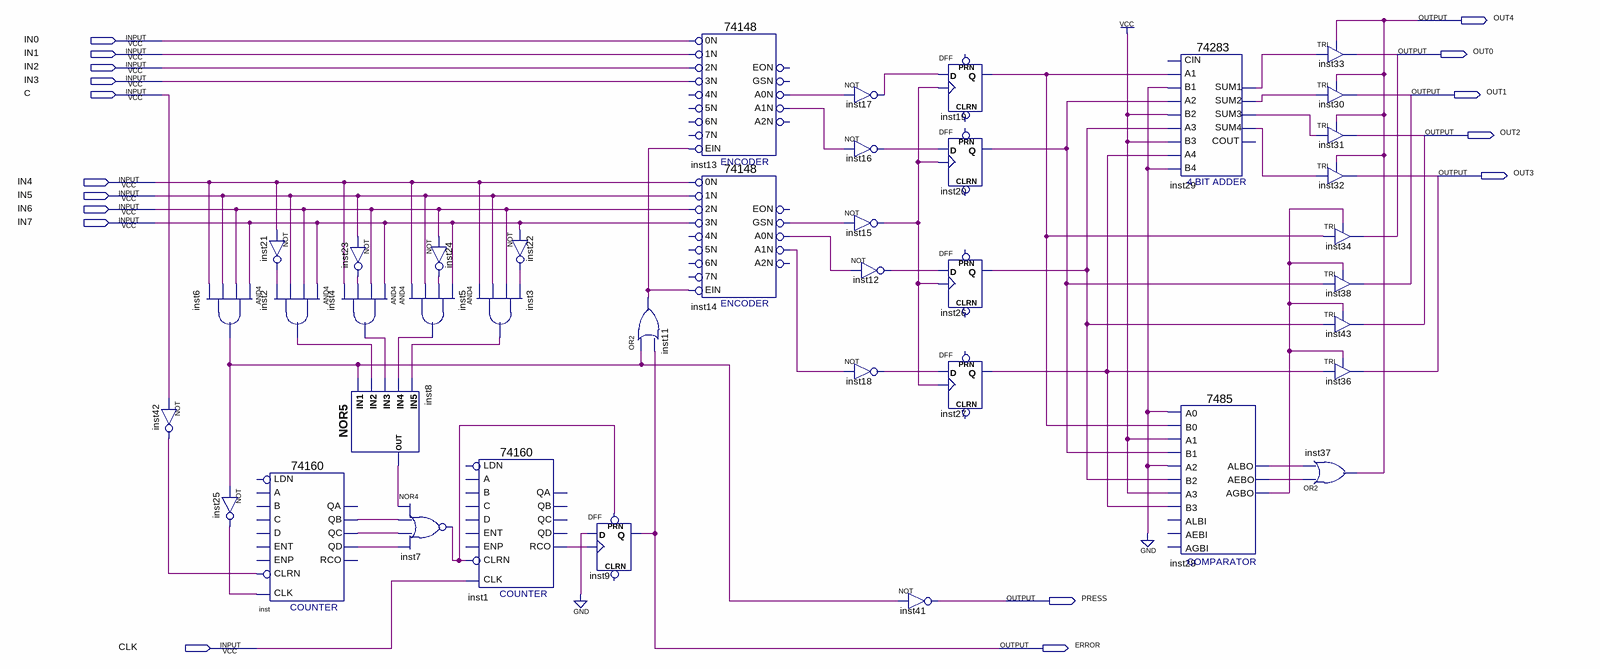
[diagram p0: schematic sheet]
// Quartus schematic detect.bdf as structural Verilog: 40 symbols, 17 pins
module detect (
  input  IN0,
  input  IN1,
  input  IN2,
  input  IN3,
  input  C,
  input  IN4,
  input  IN5,
  input  IN6,
  input  IN7,
  input  CLK,
  output OUT4,
  output OUT0,
  output OUT1,
  output OUT2,
  output OUT3,
  output PRESS,
  output ERROR
);

  wire inst1_rco, inst2_out, inst3_out, inst4_out, inst5_out, inst6_out, inst7_out, inst8_out, inst11_out,
       inst12_out, inst13_a0n, inst13_a1n, inst14_a0n, inst14_a1n, inst14_gsn, inst15_out, inst16_out,
       inst17_out, inst18_out, inst19_q, inst20_q, inst21_out, inst22_out, inst23_out, inst24_out,
       inst25_out, inst26_q, inst27_q, inst28_aebo, inst28_agbo, inst28_albo, inst29_sum1, inst29_sum2,
       inst29_sum3, inst29_sum4, inst42_out, inst_qb, inst_qc, inst_qd;

  not inst42 (inst42_out, C);
  and inst6 (inst6_out, IN7, IN6, IN5, IN4);
  not inst21 (inst21_out, IN4);
  and inst2 (inst2_out, IN7, IN6, IN5, inst21_out);
  \74160  inst (
    .CLK(inst25_out), .CLRN(inst42_out), .QD(inst_qd), .QB(inst_qb), .QC(inst_qc));  // open: ENT, A, B, C, D, LDN, ENP, QA, RCO
  not inst25 (inst25_out, inst6_out);
  not inst23 (inst23_out, IN5);
  and inst4 (inst4_out, IN7, IN6, inst23_out, IN4);
  nor inst8 (inst8_out, inst6_out, inst2_out, inst4_out, inst5_out, inst3_out);
  not inst24 (inst24_out, IN6);
  and inst5 (inst5_out, IN4, IN5, inst24_out, IN7);
  nor inst7 (inst7_out, inst8_out, inst_qb, inst_qc, inst_qd);
  and inst3 (inst3_out, IN4, IN5, IN6, inst22_out);
  \74160  inst1 (.CLK(CLK), .CLRN(inst7_out), .RCO(inst1_rco));  // open: ENT, A, B, C, D, LDN, ENP, QD, QA, QB, QC
  not inst22 (inst22_out, IN7);
  DFF inst9 (.CLK(inst1_rco), .D(1'b0), .PRN(inst7_out), .Q(ERROR));  // open: CLRN
  or inst11 (inst11_out, inst6_out, ERROR);
  \74148  inst13 (
    .\0N (IN0), .\1N (IN1), .\2N (IN2), .\3N (IN3), .EIN(inst11_out), .A1N(inst13_a1n), .A0N(inst13_a0n));  // open: 5N, 4N, 6N, 7N, A2N, EON, GSN
  \74148  inst14 (
    .\0N (IN4), .\1N (IN5), .\2N (IN6), .\3N (IN7), .EIN(inst11_out), .A1N(inst14_a1n), .A0N(inst14_a0n),
    .GSN(inst14_gsn));  // open: 5N, 4N, 6N, 7N, A2N, EON
  not inst17 (inst17_out, inst13_a0n);
  not inst16 (inst16_out, inst13_a1n);
  not inst15 (inst15_out, inst14_gsn);
  not inst12 (inst12_out, inst14_a0n);
  not inst18 (inst18_out, inst14_a1n);
  not inst41 (PRESS, inst6_out);
  DFF inst19 (.CLK(inst15_out), .D(inst17_out), .Q(inst19_q));  // open: CLRN, PRN
  DFF inst20 (.CLK(inst15_out), .D(inst16_out), .Q(inst20_q));  // open: CLRN, PRN
  DFF inst26 (.CLK(inst15_out), .D(inst12_out), .Q(inst26_q));  // open: CLRN, PRN
  DFF inst27 (.CLK(inst15_out), .D(inst18_out), .Q(inst27_q));  // open: CLRN, PRN
  \74283  inst29 (
    .A1(inst19_q), .A2(inst20_q), .B2(1'b1), .A3(inst26_q), .A4(inst27_q), .B4(1'b0), .B1(1'b0), .B3(1'b1),
    .SUM4(inst29_sum4), .SUM1(inst29_sum1), .SUM2(inst29_sum2), .SUM3(inst29_sum3));  // open: CIN, COUT
  \7485  inst28 (
    .A3(1'b1), .B2(inst26_q), .A2(1'b0), .A0(1'b0), .B0(inst19_q), .B3(inst27_q), .A1(1'b1), .B1(inst20_q),
    .ALBO(inst28_albo), .AGBO(inst28_agbo), .AEBO(inst28_aebo));  // open: AEBI, AGBI, ALBI
  TRI inst33 (.IN(inst29_sum1), .OE(OUT4), .OUT(OUT0));
  TRI inst30 (.IN(inst29_sum2), .OE(OUT4), .OUT(OUT1));
  TRI inst31 (.IN(inst29_sum3), .OE(OUT4), .OUT(OUT2));
  TRI inst32 (.IN(inst29_sum4), .OE(OUT4), .OUT(OUT3));
  TRI inst34 (.IN(inst19_q), .OE(inst28_agbo), .OUT(OUT0));
  TRI inst38 (.IN(inst20_q), .OE(inst28_agbo), .OUT(OUT1));
  TRI inst43 (.IN(inst26_q), .OE(inst28_agbo), .OUT(OUT2));
  TRI inst36 (.IN(inst27_q), .OE(inst28_agbo), .OUT(OUT3));
  or inst37 (OUT4, inst28_aebo, inst28_albo);
endmodule
